# EAGLE schematic Pulsox (EAGLE 9.6.2)
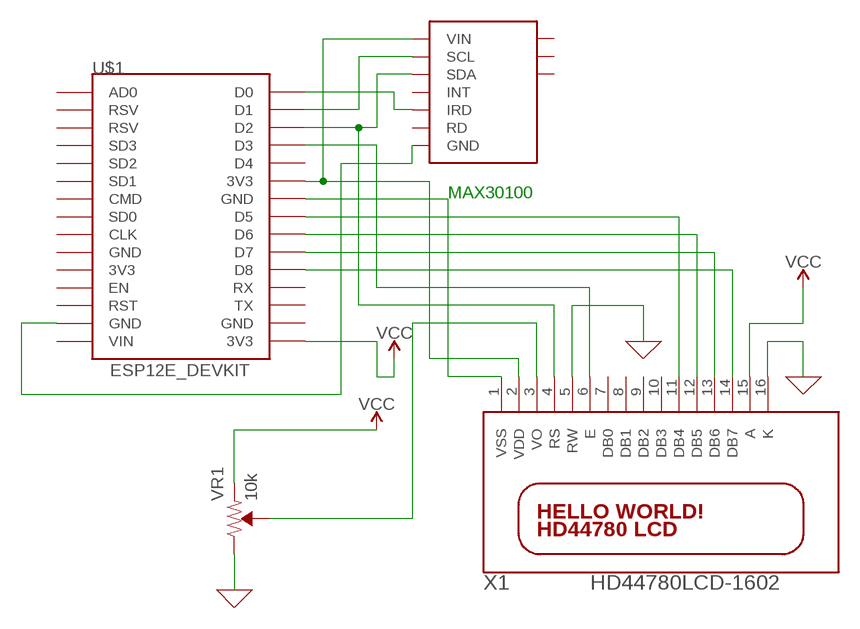
[diagram p0: schematic, sheet 1]

## Parts
MAX30100  MAX30100  [MAX30100]
U$1  ESP12E_DEVKIT  [ESP12E_DEVKIT]
VR1  10k  TRIMPOT-PTH-10MM-KNOB-1/2W-10%  [TRIMPOT-PTH-3386U]
X1  HD44780LCD-1602  [LCD1602]

## Nets
0: VR1.3(CW) X1.5(RW) X1.16(K) ; supply symbol labelled GND
N$2: MAX30100.3(SCL) U$1.D1
N$3: MAX30100.4(SDA) U$1.D2 X1.4(RS)
N$4: MAX30100.6(IRD) U$1.D0
N$5: MAX30100.9(GND) U$1.GND@1(GND)
N$6: U$1.D8 X1.14(DB7)
N$7: U$1.D7 X1.13(DB6)
N$8: U$1.D6 X1.12(DB5)
N$9: U$1.D5 X1.11(DB4)
N$10: U$1.D3 X1.6(E)
N$11: VR1.2(WIPER) X1.3(VO)
VCC: U$1.3V3@2(3V3) VR1.1(CCW) X1.15(A)
VDD: MAX30100.2(VIN) U$1.3V3@1(3V3) X1.2(VDD)
VSS: U$1.GND@2(GND) X1.1(VSS)
Unconnected: MAX30100.5(INT) MAX30100.10(RD) MAX30100.11 MAX30100.12 MAX30100.13 U$1.3V3@0(3V3) U$1.AD0 U$1.CLK U$1.CMD U$1.D4 U$1.EN U$1.GND@0(GND) U$1.GND@3(GND) U$1.RST U$1.RSV@0(RSV) U$1.RSV@1(RSV) U$1.RX U$1.SD0 U$1.SD1 U$1.SD2 U$1.SD3 U$1.TX U$1.VIN X1.7(DB0) X1.8(DB1) X1.9(DB2) X1.10(DB3)

## Notes on the sheet
- MAX30100

## Library data of the parts
MAX30100 = MAX30100:MAX30100
U$1 = ESP12E_DEVKIT:ESP12E_DEVKIT: ESP12E DEVKIT BOARD
VR1 = SparkFun-Resistors:TRIMPOT: Trimming Potentiometer (Trimpot) Three-terminal potentiometers, with an adjustable wiper and two adjustable resistors. A pot can be used to create a configurable voltage divider, or as a variable resistor. "Trimpots" are a subset of potentiometers, usually intended for "set-and-forget" applications. They're often more delicate than standard potentiometers - rated for fewer turns. Variants PTH-KNOB - PTH Trimpot w/ finger-adjustable knob Trimpot 10K with Knob <https://www.sparkfun.com/products/9806> (COM-09806) Datasheet <http://www.sparkfun.com/datasheets/Components/General/TSR-3386.pdf> SMD-3MM-CLOSED-FRAME - SMD 3mm Square Closed-Frame Trimpot Used on e.g. EasyDriver - Stepper Motor Driver <https://www.sparkfun.com/products/12779> Datasheet <http://www.bitechnologies.com/pdfs/22.pdf> (22AR10KTR) SMD-5MM - SMD 5mm Square Closed-Frame Trimpot Used on e.g. IOIO-OTG - V2.2 <https://www.sparkfun.com/products/13613> Datasheet <http://www.vishay.com/docs/51008/ts53.pdf> (TS53YL502MR10) SMD-3MM-1/10W-25% - 3mm Square Open-Frame Trimpot Used on e.g. SparkFun Shapeoko <https://www.sparkfun.com/products/13899> Datasheet <http://www.bourns.com/docs/Product-Datasheets/TC33.pdf> (TC33X-2-103E); PROD_ID: RES-09730; SF_SKU: COM-09806
X1 = adafruit:HD44780LCD: HD44780 LCD Standard character type LCDs, available in sizes from 8x1 to 40x4!